# Altium schematic sheet MC34063Inverting.SchDoc
size A
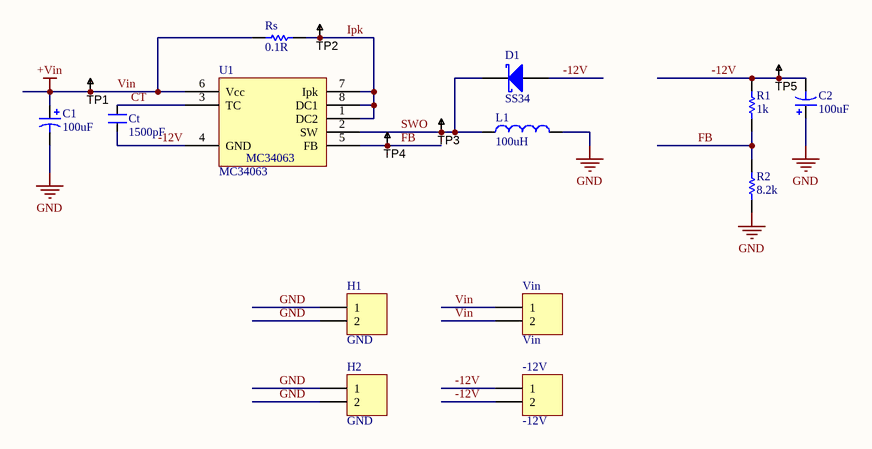
[diagram p0: MC34063Inverting.SchDoc]

## Parts
-12V  -12V  [HDR1X2]
C1  value 100uF  [CAP_ELEC_SIZE_H13]  (hidden comment: Cap)
C2  value 100uF  [CAP_ELEC_SIZE_H13]  (hidden comment: Cap)
Ct  value 1500pF  [CAPC2012N_F]  (hidden comment: CAP NP)
D1  SS34  [DO-214AC]
H1  GND  [HDR1X2]
H2  GND  [HDR1X2]
L1  value 100uH  [Inductor C8x10]  (hidden comment: Inductor)
R1  value 1k  [RESC2012N_F]  (hidden comment: Res)
R2  value 8.2k  [RESC2012N_F]  (hidden comment: Res)
Rs  value 0.1R  [RESC6332N]  (hidden comment: Res)
TP1  TESTPOINT  [TP-R60]  (value not drawn)  (no BOM)
TP2  TESTPOINT  [TP-R60]  (value not drawn)  (no BOM)
TP3  TESTPOINT  [TP-R60]  (value not drawn)  (no BOM)
TP4  TESTPOINT  [TP-R60]  (value not drawn)  (no BOM)
TP5  TESTPOINT  [TP-R60]  (value not drawn)  (no BOM)
U1  MC34063  [SO 8]
Vin  Vin  [HDR1X2]

## Nets
GND: C1.2 C2.1 H1.1 H1.2 H2.1 H2.2 L1.2 R2.1
Vin: C1.1 Rs.1 TP1.1 U1.6(Vcc) Vin.1 Vin.2  [also labelled +Vin]
-12V: -12V.1 -12V.2 C2.2 Ct.1 D1.1(A) R1.2 TP5.1 U1.4(GND)
CT: Ct.2 U1.3(TC)
FB: R1.1 R2.2 TP4.1 U1.5(FB)
Ipk: Rs.2 TP2.1 U1.1(DC2) U1.7(Ipk) U1.8(DC1)
SWO: D1.2(K) L1.1 TP3.1 U1.2(SW)

## Library data of the parts
-12V H1 H2 Vin = Header 2: Header, 2-Pin; LatestRevisionDate: 17-Jul-2002; LatestRevisionNote: Re-released for DXP Platform.; Publisher: Altium Limited
D1 = Diode Schottky: pin to pad: 1>A 2>K
TP1-TP5 = TESTPOINT: SMD test pin